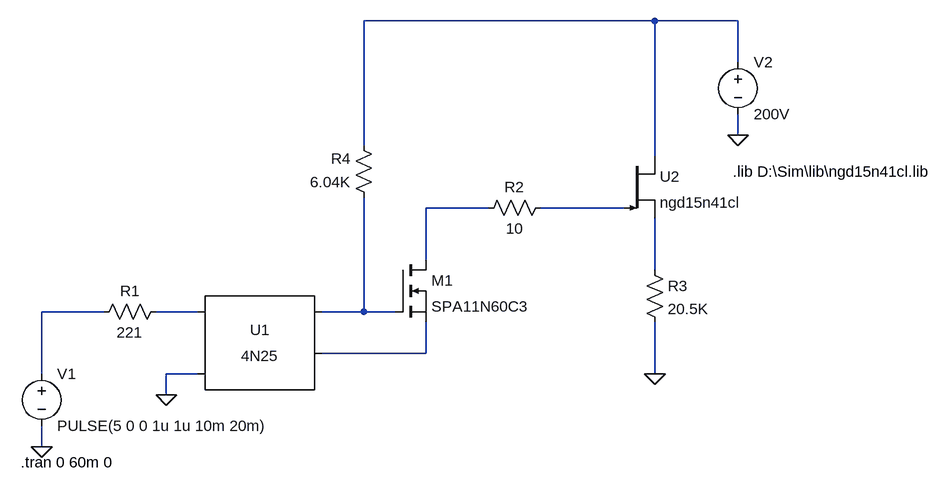
[diagram p0: schematic disparo_igbt_alto.asc]
disparo_igbt_alto.asc, the LTspice schematic file:
Version 4
SHEET 1 1516 680
WIRE 992 -432 544 -432
WIRE 1120 -432 992 -432
WIRE 1120 -368 1120 -432
WIRE 1120 -256 1120 -288
WIRE 544 -240 544 -432
WIRE 992 -224 992 -432
WIRE 736 -144 640 -144
WIRE 944 -144 816 -144
WIRE 640 -64 640 -144
WIRE 992 -48 992 -128
WIRE 144 16 48 16
WIRE 288 16 224 16
WIRE 544 16 544 -160
WIRE 544 16 480 16
WIRE 592 16 544 16
WIRE 640 80 640 32
WIRE 640 80 480 80
WIRE 48 112 48 16
WIRE 288 112 240 112
WIRE 992 112 992 32
WIRE 240 144 240 112
WIRE 48 224 48 192
FLAG 48 224 0
FLAG 240 144 0
FLAG 1120 -256 0
FLAG 992 112 0
SYMBOL voltage 48 96 R0
WINDOW 123 0 0 Left 2
WINDOW 39 0 0 Left 2
SYMATTR InstName V1
SYMATTR Value PULSE(5 0 0 1u 1u 10m 20m)
SYMBOL Optos\\4N25 384 80 R0
SYMATTR InstName U1
SYMBOL res 240 0 R90
WINDOW 0 0 56 VBottom 2
WINDOW 3 32 56 VTop 2
SYMATTR InstName R1
SYMATTR Value 221
SYMATTR SpiceLine tol=1 pwr=0.1
SYMBOL nmos 592 -64 R0
SYMATTR InstName M1
SYMATTR Value SPA11N60C3
SYMBOL res 832 -160 R90
WINDOW 0 0 56 VBottom 2
WINDOW 3 32 56 VTop 2
SYMATTR InstName R2
SYMATTR Value 10
SYMATTR SpiceLine tol=1 pwr=0.1
SYMBOL Misc\\nigbt 944 -224 R0
SYMATTR InstName U2
SYMATTR Value ngd15n41cl
SYMBOL voltage 1120 -384 R0
WINDOW 123 0 0 Left 2
WINDOW 39 0 0 Left 2
SYMATTR InstName V2
SYMATTR Value 200V
SYMBOL res 976 -64 R0
SYMATTR InstName R3
SYMATTR Value 20.5K
SYMATTR SpiceLine tol=1 pwr=0.1
SYMBOL res 560 -144 R180
WINDOW 0 36 76 Left 2
WINDOW 3 36 40 Left 2
SYMATTR InstName R4
SYMATTR Value 6.04K
SYMATTR SpiceLine tol=1 pwr=0.1
TEXT 1112 -200 Left 2 !.lib D:\\Sim\\lib\\ngd15n41cl.lib
TEXT 16 248 Left 2 !.tran 0 60m 0

The netlist it stands for:
* disparo_igbt_alto.asc
V1 N005 0 PULSE(5 0 0 1u 1u 10m 20m)
XU1 N006 0 N007 N008 NC_01 4N25
R1 N006 N005 221 tol=1 pwr=0.1
M1 N002 N007 N008 N008 SPA11N60C3
R2 N003 N002 10 tol=1 pwr=0.1
Z§U2 N001 N003 N004 ngd15n41cl
V2 N001 0 200V
R3 N004 0 20.5K tol=1 pwr=0.1
R4 N007 N001 6.04K tol=1 pwr=0.1
.model NMOS NMOS
.model PMOS PMOS
.lib standard.mos
.lib D:\Sim\lib\ngd15n41cl.lib
.tran 0 60m 0
.lib 4N25.sub
.backanno
.end